# Altium schematic sheet Alarm_Clock.SchDoc
size A
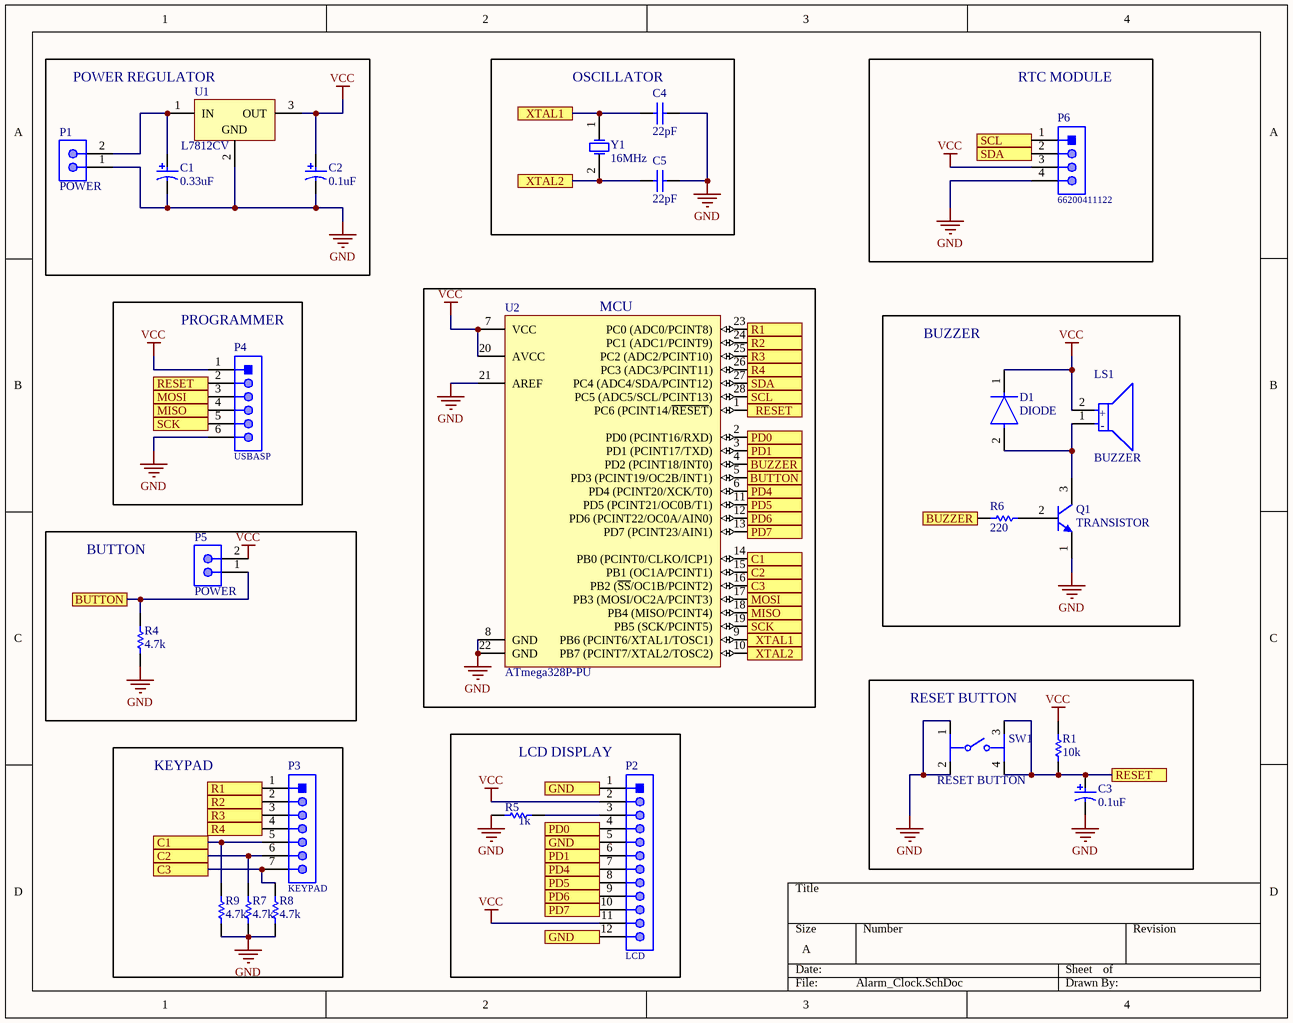
[diagram p0: Alarm_Clock.SchDoc]

## Parts
C1  0.33uF  [PNSC-FR-A-8X20-2_V]
C2  0.1uF  [PNSC-FR-A-8X20-2_V]
C3  0.1uF  [PNSC-FR-A-8X20-2_V]
C4  22pF  [KEMT-C315-THT-2]
C5  22pF  [KEMT-C315-THT-2]
D1  DIODE  [FP-017AG-MFG]
LS1  BUZZER  [FP-SDC1610M5-01-MFG]
P1  POWER  [MOLX-22-27-2021_V]
P2  LCD  [66201211122]
P3  KEYPAD  [66200711122]
P4  USBASP  [66200611122]
P5  POWER  [MOLX-22-27-2021_V]
P6  66200411122  [66200411122]
Q1  TRANSISTOR  [FAIR-TO-92-3]
R1  10k  [VISH-A1-2_V2]
R4  4.7k  [VISH-A1-2_V2]
R5  1k  [VISH-A1-2_V2]
R6  220  [VISH-A1-2_V2]
R7  4.7k  [VISH-A1-2_V2]
R8  4.7k  [VISH-A1-2_V2]
R9  4.7k  [VISH-A1-2_V2]
SW1  RESET BUTTON  [FP-1825910-2-0]
U1  L7812CV  [TO220]
U2  ATmega328P-PU  [28P3]
Y1  16MHz  [R38]

## Blocks framed on the sheet
POWER REGULATOR: C1 C2 P1 U1
OSCILLATOR: C4 C5 Y1
RTC MODULE: P6
MCU: U2
PROGRAMMER: P4
BUZZER: D1 LS1 Q1 R6
BUTTON: P5 R4
RESET BUTTON: C3 R1 SW1
KEYPAD: P3 R7-R9
LCD DISPLAY: P2 R5

## Ports
BUTTON, BUZZER, C1, C2, C3, GND, MISO, MOSI, PD0, PD1, PD4, PD5, PD6, PD7, R1, R2, R3, R4, RESET, SCK, SCL, SDA, XTAL1, XTAL2

## Nets
GND: C1.2 C2.2 C3.2 C4.2 C5.2 P1.1 P4.6 P6.4 Q1.1(E) R4.1 R5.1 R7.1 R8.1 R9.1 SW1.1 SW1.2 U1.2(GND) U2.8(GND) U2.21(AREF) U2.22(GND)
VCC: C2.1 D1.1(C) LS1.2(A) P2.2 P2.11 P4.1 P5.2 P6.3 R1.2 U1.3(OUT) U2.7(VCC) U2.20(AVCC)
BUTTON: P5.1 R4.2 U2.5(PD3_(PCINT19/OC2B/INT1)) ; port BUTTON
BUZZER: R6.1 U2.4(PD2_(PCINT18/INT0)) ; port BUZZER
C1: P3.5 R9.2 U2.14(PB0_(PCINT0/CLKO/ICP1)) ; port C1
C2: P3.6 R7.2 U2.15(PB1_(OC1A/PCINT1)) ; port C2
C3: P3.7 R8.2 U2.16(PB2_(~{SS}/OC1B/PCINT2)) ; port C3
GND: P2.1 P2.5 P2.12 ; port GND  [a separate net that carries the same name]
MISO: P4.4 U2.18(PB4_(MISO/PCINT4)) ; port MISO
MOSI: P4.3 U2.17(PB3_(MOSI/OC2A/PCINT3)) ; port MOSI
PD0: P2.4 U2.2(PD0_(PCINT16/RXD)) ; port PD0
PD1: P2.6 U2.3(PD1_(PCINT17/TXD)) ; port PD1
PD4: P2.7 U2.6(PD4_(PCINT20/XCK/T0)) ; port PD4
PD5: P2.8 U2.11(PD5_(PCINT21/OC0B/T1)) ; port PD5
PD6: P2.9 U2.12(PD6_(PCINT22/OC0A/AIN0)) ; port PD6
PD7: P2.10 U2.13(PD7_(PCINT23/AIN1)) ; port PD7
R1: P3.1 U2.23(PC0_(ADC0/PCINT8)) ; port R1
R2: P3.2 U2.24(PC1_(ADC1/PCINT9)) ; port R2
R3: P3.3 U2.25(PC2_(ADC2/PCINT10)) ; port R3
R4: P3.4 U2.26(PC3_(ADC3/PCINT11)) ; port R4
RESET: C3.1 P4.2 R1.1 SW1.3 SW1.4 U2.1(PC6_(PCINT14/~{RESET})) ; port RESET
SCK: P4.5 U2.19(PB5_(SCK/PCINT5)) ; port SCK
SCL: P6.1 U2.28(PC5_(ADC5/SCL/PCINT13)) ; port SCL
SDA: P6.2 U2.27(PC4_(ADC4/SDA/PCINT12)) ; port SDA
XTAL1: C4.1 U2.9(PB6_(PCINT6/XTAL1/TOSC1)) Y1.1(OSC1) ; port XTAL1
XTAL2: C5.1 U2.10(PB7_(PCINT7/XTAL2/TOSC2)) Y1.2(OSC2) ; port XTAL2
NetC1_1: C1.1 P1.2 U1.1(IN)
NetD1_2: D1.2(A) LS1.1(C) Q1.3(C)
NetP2_3: P2.3 R5.2
NetQ1_2: Q1.2(B) R6.2

## Notes on the sheet
- (in symbol CMP-08413-000008-1) +; -

## Library data of the parts
C1-C3 = CMP-0744-00002-1: Aluminum Electrolytic Capacitor, 1000 uF +/- 20%, 16 V, -40 to 105 degC, 2-Pin THD, Dia 8 mm, Body Length 22 mm, RoHS; PartNumber: EEU-FR1C102L; Manufacturer: Panasonic; Rated Voltage: 16 V; Resistance: 0.03 Ohm; Tolerance: +/- 20%; Rated Ripple Current: 1560 mA; Capacitance: 1000 uF; ComponentLink2URL: http://www.panasonic.com/industrial/includes/pdf/EEU-FR_DataSheet.pdf; DatasheetVersion: Apr-10; Temperature Range: -40 to 105 degC; ComponentLink1Description: Manufacturer URL; ComponentLink1URL: http://www.panasonic.com/industrial/electronic-components/; PackageDescription: 2-Pin Radial Lead, Dia 8 mm, Body Length 22 mm, Pin Spacing 3.5 mm; PackageReference: FR-A-8X20-2; Mounting Technology: Through Hole; RoHS: TRUE; ComponentLink2Description: Datasheet
C4 C5 = CMP-1664-00007-1: Capacitor, Ceramic, 0.01 uF, +/- 10%, 100 V, X7R, -55 to 125 degC, 2-Pin THD, RoHS, Bulk; Output Voltage: 70 V; Case\Package: PDIP; Forward Current: 60 mA; Nominal Vf: 1.3 V; Forward Voltage: 1.5 V; Channels: 2; Max Power Dissipation: 400 mW; Vce Max: 500 mV; ComponentLink1Description: Manufacturer URL; ComponentLink2Description: Datasheet; Packaging: Rail/Tube; RoHSCompliant: true; Package Quantity: 2000; PackageReference: C315-THT-2; Min Operating Temperature: -55 degC; Max Operating Temperature: 100 degC; Radiation Hardening: No; ComponentLink1URL: http://www.kemet.com/; DatasheetVersion: Aug-16; Pins: 16; PackageDescription: 2-Pin Through Hole Device, Body 3.81 x 2.54 mm; REACH SVHC: Unknown; Mount: Through Hole; ComponentLink2URL: http://capacitoredge.kemet.com/capedge2/DataSheet/Datasheet-C315C103K1R5TA.pdf?pn=C315C103K1R5TA{BULK}
D1 = CMP-07163-000006-1: DIODE GEN PURP 15V 150MA DO35; Manufacturer Part Number: FJH1100; Manufacturer: ON Semiconductor; Peak Reverse Current: 0.00001uA; Value: 2pF; Reverse Voltage: 30V; Max Junction Temp: +175°C; Footprint Url: https://www.onsemi.com/pub/Collateral/017AG.PDF; Device Class L2: Diodes; Digikey Description: DIODE GEN PURP 15V 150MA DO35; Mouser Description: Rectifiers Small Signal Diode; Forward Current: 150mA; Lead Free: Yes; Height: 1.91mm; Device Class L1: Discrete Semiconductors; Device Class L3: Rectifier Diodes; Temperature Range High: +175°C; Automotive: No; ComponentLink2Description: Datasheet; Octopart: https://octopart.com/fjh1100-on+semiconductor-84327057; RoHS: TRUE; Package: 017AG; Capacitance: 2pF; Temperature: to +175°C; Category: Diode; ComponentLink2URL: https://www.onsemi.com/pub/Collateral/FJH1100-D.pdf
LS1 = CMP-08413-000008-1: AUDIO MAGNETIC INDICATOR 4-8V TH; Nominal Supply Voltage (DC): 5V; Input Type: DC; Max Supply Current: 30mA; Number of Terminals/Pins: 2; Frequency: 2.4kHz; Lead Free: Lead Free; Operating Supply Current: 30mA; Sensing Method: Magnetic; Termination: PC Pins; Number of Pins: 2; Mount: Through Hole; Min Operating Temperature: -10°C; Diameter: 16mm; Series: SDC; Max Operating Temperature: 70°C; Packaging: Tray; Voltage Rating: 5V; Height: 10mm
P1 P5 = CMP-2000-05537-1: Male Header, Pitch 2.54 mm, 1 x 2 Position, Height 11.7 mm, Tail Length 3.56 mm, 0 to 75 degC, RoHS, Bulk; Manufacturer: Molex; PartNumber: 0022272021; Current rating: 4A; Package Version: Rev. BC, 02/2012; Voltage rating: 250V; No. of Positions: 2; Pitch: 2.54mm; No. of Rows: 1; Orientation: Vertical; Operating temperature: 0°Cto+75°C; Manufacturer URL: http://www.molex.com/; Mounting Technology: ThroughHole; Housing material: Nylon(UL94V-0); Package Description: 2-Leads Header, Body 5.08 x 5.8 mm, Pitch 2.54 mm; Voltage - Max: 250V; Datasheet URL: http://www.molex.com/pdm_docs/sd/022272021_sd.pdf; Package Reference: 22-27-2021; Contact material: Tinplatedbrass; Current - Max: 4A; Datasheet Version: Rev. F, 06/2009
P2 = CMP-1502-00450-1: THT Male Header WR-MPC3, Vertical, Single Row, pitch 3 mm, 12 pins; Manufacturer: Wurth Elektronik; Pin Number: 12; Working Voltage: 250VAC; Contact Resistance: 10mOhm; Pitch: 3mm; Datasheet URL: https://katalog.we-online.de/em/datasheet/6620xx11122.pdf; Part Number: 66201211122; Manufacturer URL: http://www.we-online.de; Package Reference: 66201211122; Operating Temperature: -40to105degC; Gender: Male; Mounting Technology: THT; Publisher: WurthElektronik; Packaging: Tube; Orientation: Vertical
P3 = CMP-1502-00445-1: THT Male Header WR-MPC3, Vertical, Single Row, pitch 3 mm, 7 pins; Manufacturer: Wurth Elektronik; Contact Resistance: 10mOhm; Pin Number: 7; Working Voltage: 250VAC; Pitch: 3mm; Manufacturer URL: http://www.we-online.de; Gender: Male; Orientation: Vertical; Publisher: WurthElektronik; Mounting Technology: THT; Part Number: 66200711122; Package Reference: 66200711122; Datasheet URL: https://katalog.we-online.de/em/datasheet/6620xx11122.pdf; Packaging: Tube; Operating Temperature: -40to105degC
P4 = CMP-1502-00444-1: THT Male Header WR-MPC3, Vertical, Single Row, pitch 3 mm, 6 pins; Manufacturer: Wurth Elektronik; Working Voltage: 250VAC; Contact Resistance: 10mOhm; Pin Number: 6; Pitch: 3mm; Package Reference: 66200611122; Manufacturer URL: http://www.we-online.de; Packaging: Tube; Operating Temperature: -40to105degC; Publisher: WurthElektronik; Datasheet URL: https://katalog.we-online.de/em/datasheet/6620xx11122.pdf; Mounting Technology: THT; Gender: Male; Part Number: 66200611122; Orientation: Vertical
P6 = CMP-1502-00442-1: THT Male Header WR-MPC3, Vertical, Single Row, pitch 3 mm, 4 pins; Manufacturer: Wurth Elektronik; Contact Resistance: 10mOhm; Working Voltage: 250VAC; Pin Number: 4; Pitch: 3mm; Manufacturer URL: http://www.we-online.de; Package Reference: 66200411122; Packaging: Tube; Part Number: 66200411122; Publisher: WurthElektronik; Orientation: Vertical; Mounting Technology: THT; Gender: Male; Operating Temperature: -40to105degC; Datasheet URL: https://katalog.we-online.de/em/datasheet/6620xx11122.pdf
Q1 = CMP-2000-06911-1: NPN General-Purpose Amplifier, 40 V, -55 to 150 degC, 3-Pin TO-92, RoHS, Tape and Reel; Manufacturer: FairchildSemiconductor; Configuration: Single; Collector-Emitter Saturation Voltage: 1V; Collector- Emitter Voltage VCEO Max: 40V; Unit Weight: 0.008466oz; Maximum DC Collector Current: 1A; DC Collector/Base Gain hfe Min: 100; Emitter- Base Voltage VEBO: 6V; Maximum Power Dissipation: 625mW; DC Current Gain hFE Max: 300; Gain Bandwidth Product fT: 300MHz; Collector- Base Voltage VCBO: 75V; Mounting Style: ThroughHole; Package Description: 3-Pin Transistor Outline Package, Body Dia 4.79 mm, Pitch 2.6 mm; Mounting Technology: ThroughHole; RoHS: Details; Brand: FairchildSemiconductor; Minimum Operating Temperature: -55C; Package / Case: TO-92-3KinkedLead; Package Reference: TO-92; Series: PN2222; Packaging: Reel; Datasheet Version: Rev. 1.1.0, 07/2014; Datasheet URL: https://www.fairchildsemi.com/datasheets/PN/PN2222A.pdf; Maximum Operating Temperature: +150C; Transistor Polarity: NPN; Factory Pack Quantity: 2000; Manufacturer URL: https://www.fairchildsemi.com/; <PCN>: http://www.mouser.com/PCN/3.26.10LTBDFairchild.pdf; Product Category: BipolarTransistors-BJT
R1 R4-R9 = CMP-1240-00001-1: Power Metal Film Leaded Resistor, 62 KOhm +/-5%, 2 W, 2-Pin THD, RoHS, Ammo Pack; PartNumber: PR02000206202JA100; Manufacturer: Vishay Semiconductor; Resistance: 62 KOhm; Temperature Coefficient: +/-250 ppm/degC; Power: 2 W; ComponentLink2URL: http://www.vishay.com/docs/28729/28729.pdf; Mounting Technology: Through Hole; Tolerance: +/-5%; ComponentLink3Description: Package Specification; ComponentLink3URL: http://www.vishay.com/docs/28729/28729.pdf; ComponentLink1Description: Manufacturer URL; ComponentLink2Description: Datasheet; DatasheetVersion: Jun-13; PackageDescription: 2-Pin Axial Lead, Body 10 x 3.9 mm; ComponentLink1URL: http://www.vishay.com/; Packing: Ammo Pack; RoHS: TRUE
SW1 = CMP-03407-000004-1: SWITCH TACTILE SPST-NO 0.05A 24V; Manufacturer: TE; Manufacturer Part Number: 1825910-2; Contact Current Rating: 50mA; Operating Force: 160gf; Contact Resistance: 100mΩ; Electromechanical Life: 100000Cycles; Package: 0; ComponentLink2Description: Datasheet; Digikey Description: SWITCH TACTILE SPST-NO 0.05A 24V; Octopart: https://octopart.com/1825910-2-te+connectivity-42270502; Temperature Range Low: -35°C; Temperature Range High: +85°C; Lead Free: Yes; Device Class L2: Switches; Automotive: No; Temperature: -35°C to +85°C; Device Class L1: Electromechanical; Category: Switch; ComponentLink2URL: https://www.te.com/commerce/DocumentDelivery/DDEController?Action=showdoc&DocId=Customer+Drawing%7F1825910%7FC10%7Fpdf%7FEnglish%7FENG_CD_1825910_C10.pdf%7F1825910-2; Mount: Through Hole; RoHS: TRUE; Height: 4.6mm; Device Class L3: Tactile Switches; Voltage Rating Dc: 24V; Throw Configuration: SPST-NO
U1 = CMP-0244-00450-1: Positive Voltage Regulator, 12V, 3-Pin TO-220; PackageDescription: TO, Thru-Hole, Vertical, Heatsink Mounted; 3 In-Line Leads; Pitch 2.54 mm; ComponentLink3URL: http://www.st.com/internet/com/TECHNICAL_RESOURCES/TECHNICAL_LITERATURE/PACKAGE_INFORMATION/CD00004649.pdf; ComponentLink1URL: http://www.st.com; ComponentLink2Description: Datasheet; ComponentLink3Description: Package Specification; ComponentLink2URL: http://www.st.com/internet/com/TECHNICAL_RESOURCES/TECHNICAL_LITERATURE/DATASHEET/CD00000444.pdf; DatasheetVersion: 16/11/2011; PackageVersion: ver3.0; PackageReference: TO220; ComponentLink1Description: Manufacturer URL
U2 = CMP-0095-00013-2: 8-bit AVR Microcontroller, 32KB Flash, 1KB EEPROM, 2KB SRAM, 28-pin PDIP, Industrial Grade (-40°C to 85°C); RevisionNote: DatasheetVersion updated. URLs added.; PackageVersion: revB, Sep-2001; PackageDescription: 28-lead (0.300"/7.62mm Wide) Plastic Dual Inline Package (PDIP); DatasheetVersion: revD, May-2011; ComponentLink1Description: Manufacturer URL; ComponentLink1URL: http://www.atmel.com/; PackageReference: 28P3; ComponentLink2Description: ATmega48A/48PA/88A/88PA/168A/168PA/328/328P Datasheet; ComponentLink3URL: http://www.atmel.com/dyn/resources/prod_documents/8271S.pdf; ComponentLink2URL: http://www.atmel.com/dyn/resources/prod_documents/8271.pdf; ComponentLink3Description: ATmega48A/48PA/88A/88PA/168A/168PA/328/328P Summary
Y1 = XTAL: Crystal Oscillator; Published: 8-Jun-2000; LatestRevisionDate: 17-Jul-2002; LatestRevisionNote: Re-released for DXP Platform.; PackageReference: R38; Publisher: Altium Limited; PackageDescription: Crystal, Thru-Hole; 2 Leads; Body 3.1 x 8.2 mm (Dia.xH)